# Altium schematic sheet 1ms Debouncer.SchDoc
size A4
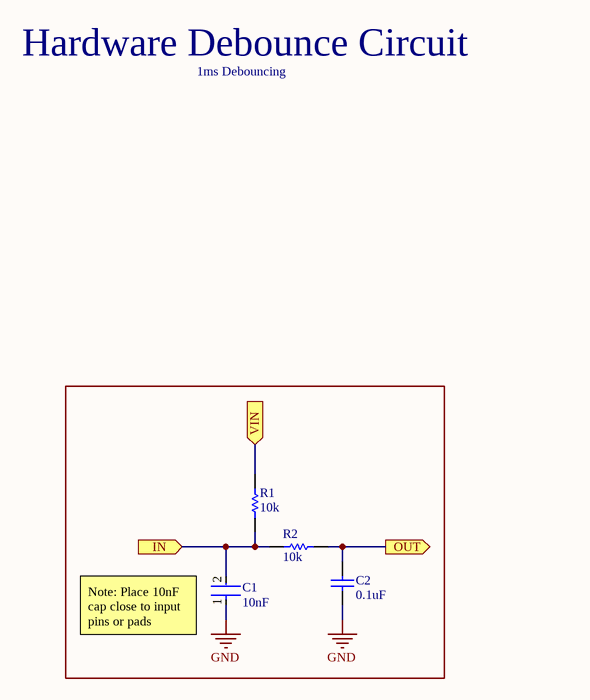
[diagram p0: 1ms Debouncer.SchDoc]

## Parts
C1  10nF  [FP-CL21-IPC_A]
C2  0.1uF  [CAPC2013X95X45ML10T25]
R1  10k  [RESC2013X70X40LL20T20]
R2  10k  [RESC2013X70X40LL20T20]

## Ports
IN (in), OUT (out), VIN (in)

## Nets
GND: C1.1 C2.2
IN: C1.2 R1.1 R2.2 ; port IN
OUT: C2.1 R2.1 ; port OUT
VIN: R1.2 ; port VIN

## Notes on the sheet
- Hardware Debounce Circuit
- 1ms Debouncing
- (near C1) Note: Place 10nF cap close to input pins or pads

## Library data of the parts
C1 = CMP-13271-003077-1: CL21 Series 0805 10nF 100V ±10% Tolerance X7R Multilayer Ceramic Chip Capacitor; Manufacturer: Samsung; Manufacturer Part Number: CL21B103KCANNNC; Voltage: 100V; Contact Plating: Tin; Height: 0.65mm; Thickness: 0.03inch; Min Operating Temperature: -55°C; Capacitance: 10nF; Length: 2mm; Max Operating Temperature: 125°C; Case Code (Imperial): 0805; Radiation Hardening: No; Dielectric: X7R; Material: Ceramic; Depth: 1.25mm; Voltage Rating: 100V; Case/Package: 0805; Tolerance: 10%; Package Quantity: 1; Width: 0.049inch; Mount: Surface Mount; Case Code (Metric): 2012; Packaging: Tape and Reel; Supplier 1: LCSC; Supplier Part Number 1: C18741; RoHS: Yes; Category: Ceramic Capacitors; Stock 1: 16900; Pricing 1: 50=0.01480, 500=0.01090, 1500=0.01020, 5000=0.00950, 25000=0.00920, 50000=0.00910, 50=0.01420, 500=0.01050, 1500=0.00990, 5000=0.00920, 25000=0.00890, 50000=0.00870, 50=0.07310, 500=0.05410, 1500=0.05060, 5000=0.04710, 25000=0.04560, 50000=0.04480, 50=0.06800, 500=0.05030, 1500=0.04700, 5000=0.04380, 25000=0.04230, 50000=0.04160, 50=0.00910, 500=0.00680, 1500=0.00630, 5000=0.00590, 25000=0.00570, 50000=0.00560, 50=0.00840, 500=0.00620, 1500=0.00580, 5000=0.00540, 25000=0.00520, 50000=0.00510, 50=0.08390, 500=0.06200, 1500=0.05800, 5000=0.05400, 25000=0.05230, 50000=0.05140, 50=1.13470, 500=0.83950, 1500=0.78530, 5000=0.73100, 25000=0.70690, 50000=0.69500, 50=0.04470, 500=0.03300, 1500=0.03090, 5000=0.02880, 25000=0.02780, 50000=0.02740, 50=0.81170, 500=0.60050, 1500=0.56170, 5000=0.52290, 25000=0.50570, 50000=0.49710, 50=0.09500, 500=0.07020, 1500=0.06570, 5000=0.06120, 25000=0.05920, 50000=0.05820, 50=0.01470, 500=0.01090, 1500=0.01020, 5000=0.00950, 25000=0.00910, 50000=0.00900, 50=0.01082, 500=0.00801, 1500=0.00749, 5000=0.00697, 25000=0.00674, 50000=0.00663 (AUD); ComponentLink1URL: https://datasheet.ciiva.com/15195/getdatasheetpartid-494350-15195869.pdf?src-supplier=Verical; ComponentLink1Description: https://datasheet.ciiva.com/15195/getdatasheetpartid-494350-15195869.pdf?src-supplier=Verical; ComponentLink2URL: https://datasheet.ciiva.com/29199/455069-da-01-en-vs-kondensator-0805-29199454.pdf?src-supplier=Conrad; ComponentLink2Description: https://datasheet.ciiva.com/29199/455069-da-01-en-vs-kondensator-0805-29199454.pdf?src-supplier=Conrad; ComponentLink3URL: https://datasheet.ciiva.com/26310/mlcc-catalogdownload2013-eng-26310214.pdf?src-supplier=Distrelec; ComponentLink3Description: https://datasheet.ciiva.com/26310/mlcc-catalogdownload2013-eng-26310214.pdf?src-supplier=Distrelec; ComponentLink4URL: https://datasheet.ciiva.com/16351/cl21b103kcannnc-16351132.pdf?src-supplier=Future+Electronics; ComponentLink4Description: https://datasheet.ciiva.com/16351/cl21b103kcannnc-16351132.pdf?src-supplier=Future+Electronics; Supplier 2: Digi-Key; Supplier Part Number 2: 1276-1249-1-ND; Stock 2: 123647; Pricing 2: 1=0.10000, 10=0.03900, 50=0.02140, 100=0.01740, 500=0.01244, 1000=0.00977 (USD)
C2 = CMP-2000-05017-1: Chip Capacitor, 0.1 uF, +/- 10%, 50 V, 0805 (2012 Metric), RoHS, Tape and Reel; Manufacturer: Samsung Electro-Mechanics; Manufacturer Part Number: CL21B104KBCNNNC; Dielectric: X7R; Capacitance: 100000pF; Rated Voltage: 50V; Material: Ceramic; Tolerance (%): ±10%; Case Size/Dimension: 0805; Datasheet URL: http://www.samsungsem.com/kr/support/product-search/mlcc/__icsFiles/afieldfile/2015/08/14/S_CL21B104KBCNNNC.pdf; Package Reference: 805; Package Description: 2-Pin Surface Mount Device, Body 2 x 1.25 mm; Manufacturer URL: http://www.samsungsem.com/global/index.jsp; Datasheet Version: Jun-15; Supplier 1: LCSC; Supplier Part Number 1: C1711; RoHS: Yes; Category: Ceramic Capacitors; Stock 1: 1573200; Pricing 1: 50=0.01180, 500=0.00860, 1500=0.00810, 5000=0.00750, 25000=0.00710, 50000=0.00710, 50=0.01140, 500=0.00830, 1500=0.00780, 5000=0.00720, 25000=0.00690, 50000=0.00680, 50=0.05850, 500=0.04280, 1500=0.04000, 5000=0.03710, 25000=0.03520, 50000=0.03490, 50=0.05440, 500=0.03980, 1500=0.03710, 5000=0.03450, 25000=0.03280, 50000=0.03250, 50=0.00730, 500=0.00530, 1500=0.00500, 5000=0.00460, 25000=0.00440, 50000=0.00440, 50=0.00670, 500=0.00490, 1500=0.00460, 5000=0.00420, 25000=0.00400, 50000=0.00400, 50=0.06710, 500=0.04910, 1500=0.04580, 5000=0.04260, 25000=0.04040, 50000=0.04010, 50=0.90790, 500=0.66380, 1500=0.61990, 5000=0.57600, 25000=0.54670, 50000=0.54190, 50=0.03570, 500=0.02610, 1500=0.02440, 5000=0.02270, 25000=0.02150, 50000=0.02130, 50=0.64940, 500=0.47480, 1500=0.44340, 5000=0.41200, 25000=0.39110, 50000=0.38760, 50=0.07600, 500=0.05560, 1500=0.05190, 5000=0.04820, 25000=0.04580, 50000=0.04530, 50=0.01170, 500=0.00860, 1500=0.00800, 5000=0.00750, 25000=0.00710, 50000=0.00700, 50=0.00866, 500=0.00633, 1500=0.00591, 5000=0.00549, 25000=0.00521, 50000=0.00517 (AUD); Mount: Surface Mount; Case/Package: 0805; Case Code (Metric): 2012; Case Code (Imperial): 0805; Contact Plating: Tin; Min Operating Temperature: -55°C; Max Operating Temperature: 125°C; Tolerance: 10%; Packaging: Tape and Reel; Voltage Rating: 50V; Voltage Rating (DC): 50V; Voltage: 50V; Length: 2mm; Height: 0.85mm; Width: 0.049inch; Depth: 1.25mm; Thickness: 0.037inch; Radiation Hardening: No; Lead Free: Lead Free; ComponentLink1URL: https://datasheet.ciiva.com/25710/cl21b104kbcnnnc-25710182.pdf?src-supplier=Digi-Key; ComponentLink1Description: https://datasheet.ciiva.com/25710/cl21b104kbcnnnc-25710182.pdf?src-supplier=Digi-Key; ComponentLink2URL: https://datasheet.ciiva.com/29199/454152-da-01-en-vs-kondensator-0805-29199814.pdf?src-supplier=Conrad; ComponentLink2Description: https://datasheet.ciiva.com/29199/454152-da-01-en-vs-kondensator-0805-29199814.pdf?src-supplier=Conrad; Supplier 2: Digi-Key; Supplier Part Number 2: 1276-1003-1-ND; Stock 2: 2187571; Pricing 2: 1=0.10000, 10=0.04700, 50=0.02560, 100=0.02100, 500=0.01498, 1000=0.01177 (USD)
R1 R2 = CMP-2001-00337-1: Part Number: ERJ-6GEYJ103V; Manufacturer: Panasonic; Resistance: 10kR; Power Rating: 125mW; Voltage Rating: 150V; Temperature Coefficient: 200ppm/°C; Tolerance: 5%; Supplier 1: LCSC; Supplier Part Number 1: C180849; Manufacturer Part Number: ERJ-6GEYJ103V; RoHS: Yes; Category: Chip SMD Resistors; Stock 1: 32950; Pricing 1: 50=0.00990, 500=0.00730, 1500=0.00680, 5000=0.00640, 25000=0.00620, 50000=0.00600, 50=0.00950, 500=0.00710, 1500=0.00660, 5000=0.00610, 25000=0.00590, 50000=0.00580, 50=0.04900, 500=0.03620, 1500=0.03380, 5000=0.03150, 25000=0.03040, 50000=0.02990, 50=0.04560, 500=0.03360, 1500=0.03150, 5000=0.02930, 25000=0.02830, 50000=0.02780, 50=0.00610, 500=0.00450, 1500=0.00420, 5000=0.00390, 25000=0.00380, 50000=0.00370, 50=0.00560, 500=0.00410, 1500=0.00390, 5000=0.00360, 25000=0.00350, 50000=0.00340, 50=0.05620, 500=0.04150, 1500=0.03880, 5000=0.03610, 25000=0.03490, 50000=0.03430, 50=0.76080, 500=0.56170, 1500=0.52510, 5000=0.48850, 25000=0.47230, 50000=0.46430, 50=0.02990, 500=0.02210, 1500=0.02070, 5000=0.01920, 25000=0.01860, 50000=0.01830, 50=0.54420, 500=0.40180, 1500=0.37560, 5000=0.34940, 25000=0.33780, 50000=0.33210, 50=0.06370, 500=0.04700, 1500=0.04390, 5000=0.04090, 25000=0.03950, 50000=0.03890, 50=0.00980, 500=0.00730, 1500=0.00680, 5000=0.00630, 25000=0.00610, 50000=0.00600, 50=0.00726, 500=0.00536, 1500=0.00501, 5000=0.00466, 25000=0.00450, 50000=0.00443 (AUD); Mount: Surface Mount; Case/Package: 0805; Case Code (Metric): 2012; Case Code (Imperial): 0805; Contact Plating: Tin; Min Operating Temperature: -55°C; Max Operating Temperature: 155°C; Packaging: Tape and Reel; Termination: SMD/SMT; Resistor Type: Thick Film; Voltage Rating (DC): 150V; Package Quantity: 5000; Number of Terminations: 2; Max Power Dissipation: 125mW; Features: Automotive AEC-Q200; Length: 2mm; Height: 0.6mm; Width: 0.049inch; Depth: 1.25mm; Radiation Hardening: No; Lead Free: Lead Free; REACH SVHC: No SVHC; Military Standard: Not; ComponentLink1URL: https://datasheet.ciiva.com/11821/0900766b80f806dd-11821504.pdf?src-supplier=RSComponents; ComponentLink1Description: https://datasheet.ciiva.com/11821/0900766b80f806dd-11821504.pdf?src-supplier=RSComponents; ComponentLink2URL: https://datasheet.ciiva.com/46386/1500035-46386469.pdf?src-supplier=Element14; ComponentLink2Description: https://datasheet.ciiva.com/46386/1500035-46386469.pdf?src-supplier=Element14; ComponentLink3URL: https://datasheet.ciiva.com/30128/4aoa0000ce1-30128839.pdf?src-supplier=Onlinecomponents.com; ComponentLink3Description: https://datasheet.ciiva.com/30128/4aoa0000ce1-30128839.pdf?src-supplier=Onlinecomponents.com; ComponentLink4URL: https://datasheet.ciiva.com/16428/aoa0000ce1-16428072.pdf?src-supplier=Future+Electronics; ComponentLink4Description: https://datasheet.ciiva.com/16428/aoa0000ce1-16428072.pdf?src-supplier=Future+Electronics; ComponentLink5URL: https://datasheet.ciiva.com/16782/70255313-16782712.pdf?src-supplier=Allied+Electronics; ComponentLink5Description: https://datasheet.ciiva.com/16782/70255313-16782712.pdf?src-supplier=Allied+Electronics; ComponentLink6URL: https://datasheet.ciiva.com/9117/aoa0000ce1-9117371.pdf?src-supplier=Avnet; ComponentLink6Description: https://datasheet.ciiva.com/9117/aoa0000ce1-9117371.pdf?src-supplier=Avnet; ComponentLink7URL: https://datasheet.ciiva.com/17212/aoa0000ce1-17212110.pdf?src-supplier=Avnet+Europe; ComponentLink7Description: https://datasheet.ciiva.com/17212/aoa0000ce1-17212110.pdf?src-supplier=Avnet+Europe; ComponentLink8URL: https://datasheet.ciiva.com/16787/70255313-16787775.pdf?src-supplier=Allied+Electronics; ComponentLink8Description: https://datasheet.ciiva.com/16787/70255313-16787775.pdf?src-supplier=Allied+Electronics; ComponentLink9URL: https://datasheet.ciiva.com/22785/1500035-22785957.pdf?src-supplier=Farnell; ComponentLink9Description: https://datasheet.ciiva.com/22785/1500035-22785957.pdf?src-supplier=Farnell; ComponentLink10URL: https://datasheet.ciiva.com/28514/1678796-28514236.pdf?src-supplier=Element14; ComponentLink10Description: https://datasheet.ciiva.com/28514/1678796-28514236.pdf?src-supplier=Element14; ComponentLink11URL: https://datasheet.ciiva.com/43460/1500035-43460125.pdf?src-supplier=Farnell; ComponentLink11Description: https://datasheet.ciiva.com/43460/1500035-43460125.pdf?src-supplier=Farnell; Supplier 2: Digi-Key; Supplier Part Number 2: P10KACT-ND; Stock 2: 3512979; Pricing 2: 1=0.10000, 10=0.04900, 100=0.02010, 1000=0.00901, 2500=0.00782 (USD)